# EAGLE design f-91ksd_r0 (EAGLE 7.7.0)
AUTHOR_NAME: koseidai
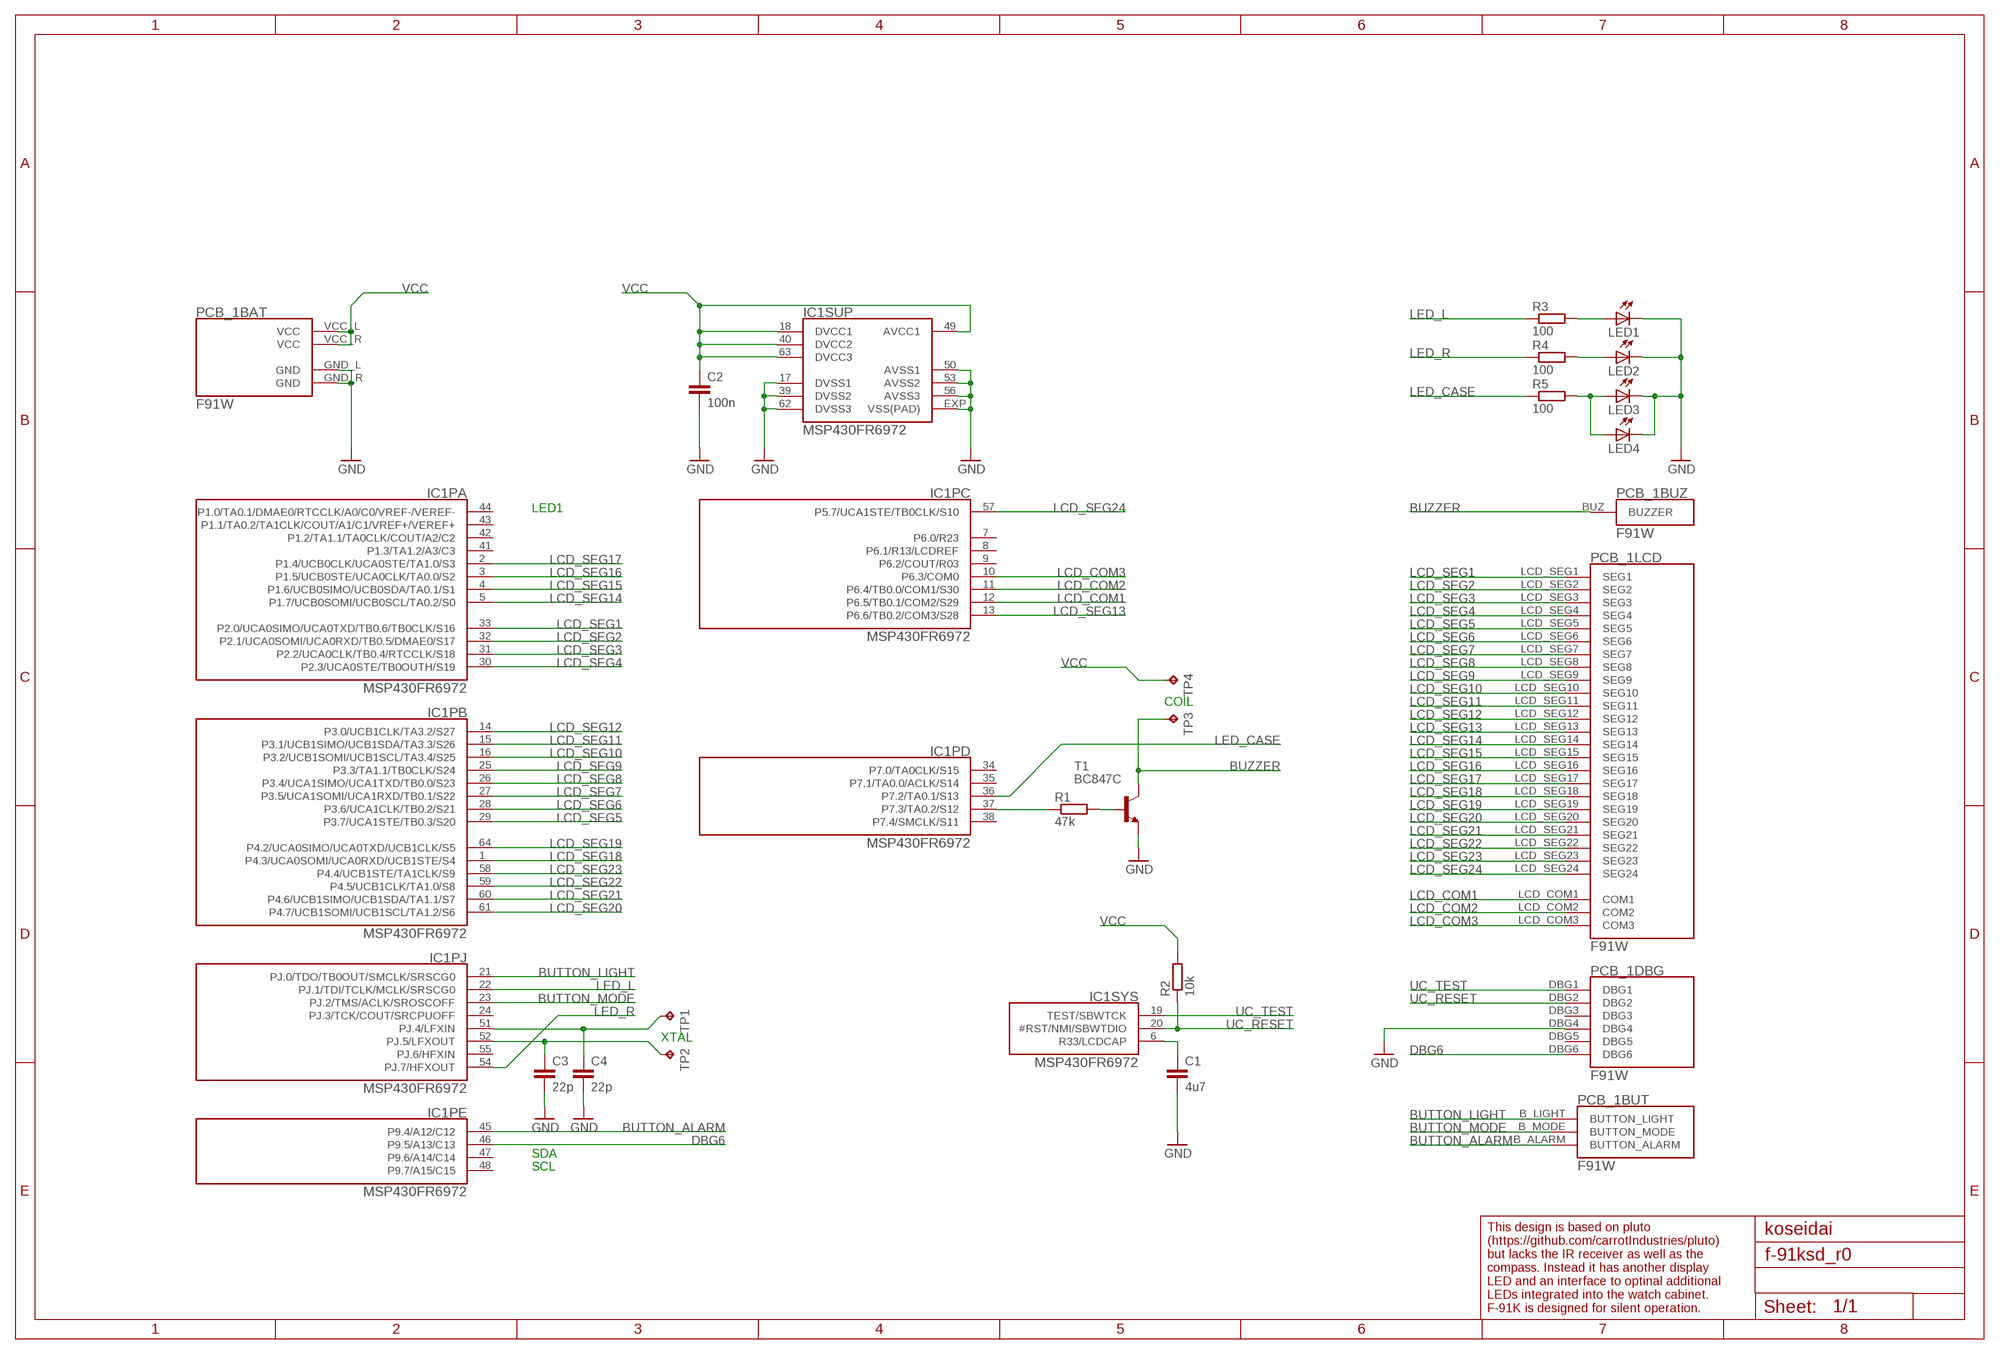
[diagram p0: schematic, sheet 1]

## Parts
C1  4u7  C-EUC0603-WW  [C0603-WW]
C2  100n  C-EUC0603-WW  [C0603-WW]
C3  22p  C-EUC0603-WW  [C0603-WW]
C4  22p  C-EUC0603-WW  [C0603-WW]
IC1  MSP430FR6972  [QFN64-9X9]
LED1  LEDCHIPLED_0805  [CHIPLED_0805]
LED2  LEDCHIPLED_0805  [CHIPLED_0805]
LED3  LEDCHIPLED_0603  [CHIPLED_0603]
LED4  LEDCHIPLED_0603  [CHIPLED_0603]
PCB_1  F91W  [F91W]
R1  47k  R-EU_R0603-WW  [R0603-WW]
R2  10k  R-EU_R0603-WW  [R0603-WW]
R3  100  R-EU_R0603-WW  [R0603-WW]
R4  100  R-EU_R0603-WW  [R0603-WW]
R5  100  R-EU_R0603-WW  [R0603-WW]
T1  BC847C  BC847C-NPN-SOT23-BEC  [SOT23-BEC]
TP1  TPTP07SQ  [TP07SQ]
TP2  TPTP07SQ  [TP07SQ]
TP3  TPTP11SQ  [TP11SQ]
TP4  TPTP11SQ  [TP11SQ]

## Nets
BUTTON_ALARM: IC1.45(PE:P9.4/A12/C12) PCB_1.B_ALARM(BUTTON_ALARM)
BUTTON_LIGHT: IC1.21(PJ:PJ.0/TDO/TB0OUT/SMCLK/SRSCG0) PCB_1.B_LIGHT(BUTTON_LIGHT)
BUTTON_MODE: IC1.23(PJ:PJ.2/TMS/ACLK/SROSCOFF) PCB_1.B_MODE(BUTTON_MODE)
BUZZER: PCB_1.BUZ(BUZZER) T1.C TP3.TP
DBG6: IC1.46(PE:P9.5/A13/C13) PCB_1.DBG6
GND: C1.2 C2.2 C3.2 C4.2 IC1.17(SUP:DVSS1) IC1.39(SUP:DVSS2) IC1.50(SUP:AVSS1) IC1.53(SUP:AVSS2) IC1.56(SUP:AVSS3) IC1.62(SUP:DVSS3) IC1.EXP(SUP:VSS(PAD)) LED1.C LED2.C LED3.C LED4.C PCB_1.DBG4 PCB_1.GND_L(GND) PCB_1.GND_R(GND) T1.E
LCD_COM1: IC1.12(PC:P6.5/TB0.1/COM2/S29) PCB_1.LCD_COM1(COM1)
LCD_COM2: IC1.11(PC:P6.4/TB0.0/COM1/S30) PCB_1.LCD_COM2(COM2)
LCD_COM3: IC1.10(PC:P6.3/COM0) PCB_1.LCD_COM3(COM3)
LCD_SEG1: IC1.33(PA:P2.0/UCA0SIMO/UCA0TXD/TB0.6/TB0CLK/S16) PCB_1.LCD_SEG1(SEG1)
LCD_SEG2: IC1.32(PA:P2.1/UCA0SOMI/UCA0RXD/TB0.5/DMAE0/S17) PCB_1.LCD_SEG2(SEG2)
LCD_SEG3: IC1.31(PA:P2.2/UCA0CLK/TB0.4/RTCCLK/S18) PCB_1.LCD_SEG3(SEG3)
LCD_SEG4: IC1.30(PA:P2.3/UCA0STE/TB0OUTH/S19) PCB_1.LCD_SEG4(SEG4)
LCD_SEG5: IC1.29(PB:P3.7/UCA1STE/TB0.3/S20) PCB_1.LCD_SEG5(SEG5)
LCD_SEG6: IC1.28(PB:P3.6/UCA1CLK/TB0.2/S21) PCB_1.LCD_SEG6(SEG6)
LCD_SEG7: IC1.27(PB:P3.5/UCA1SOMI/UCA1RXD/TB0.1/S22) PCB_1.LCD_SEG7(SEG7)
LCD_SEG8: IC1.26(PB:P3.4/UCA1SIMO/UCA1TXD/TB0.0/S23) PCB_1.LCD_SEG8(SEG8)
LCD_SEG9: IC1.25(PB:P3.3/TA1.1/TB0CLK/S24) PCB_1.LCD_SEG9(SEG9)
LCD_SEG10: IC1.16(PB:P3.2/UCB1SOMI/UCB1SCL/TA3.4/S25) PCB_1.LCD_SEG10(SEG10)
LCD_SEG11: IC1.15(PB:P3.1/UCB1SIMO/UCB1SDA/TA3.3/S26) PCB_1.LCD_SEG11(SEG11)
LCD_SEG12: IC1.14(PB:P3.0/UCB1CLK/TA3.2/S27) PCB_1.LCD_SEG12(SEG12)
LCD_SEG13: IC1.13(PC:P6.6/TB0.2/COM3/S28) PCB_1.LCD_SEG13(SEG13)
LCD_SEG14: IC1.5(PA:P1.7/UCB0SOMI/UCB0SCL/TA0.2/S0) PCB_1.LCD_SEG14(SEG14)
LCD_SEG15: IC1.4(PA:P1.6/UCB0SIMO/UCB0SDA/TA0.1/S1) PCB_1.LCD_SEG15(SEG15)
LCD_SEG16: IC1.3(PA:P1.5/UCB0STE/UCA0CLK/TA0.0/S2) PCB_1.LCD_SEG16(SEG16)
LCD_SEG17: IC1.2(PA:P1.4/UCB0CLK/UCA0STE/TA1.0/S3) PCB_1.LCD_SEG17(SEG17)
LCD_SEG18: IC1.1(PB:P4.3/UCA0SOMI/UCA0RXD/UCB1STE/S4) PCB_1.LCD_SEG18(SEG18)
LCD_SEG19: IC1.64(PB:P4.2/UCA0SIMO/UCA0TXD/UCB1CLK/S5) PCB_1.LCD_SEG19(SEG19)
LCD_SEG20: IC1.61(PB:P4.7/UCB1SOMI/UCB1SCL/TA1.2/S6) PCB_1.LCD_SEG20(SEG20)
LCD_SEG21: IC1.60(PB:P4.6/UCB1SIMO/UCB1SDA/TA1.1/S7) PCB_1.LCD_SEG21(SEG21)
LCD_SEG22: IC1.59(PB:P4.5/UCB1CLK/TA1.0/S8) PCB_1.LCD_SEG22(SEG22)
LCD_SEG23: IC1.58(PB:P4.4/UCB1STE/TA1CLK/S9) PCB_1.LCD_SEG23(SEG23)
LCD_SEG24: IC1.57(PC:P5.7/UCA1STE/TB0CLK/S10) PCB_1.LCD_SEG24(SEG24)
LED_CASE: IC1.36(PD:P7.2/TA0.1/S13) R5.1
LED_L: IC1.22(PJ:PJ.1/TDI/TCLK/MCLK/SRSCG0) R3.1
LED_R: IC1.54(PJ:PJ.7/HFXOUT) R4.1
N$1: C1.1 IC1.6(SYS:R33/LCDCAP)
N$2: IC1.37(PD:P7.3/TA0.2/S12) R1.1
N$3: C4.1 IC1.51(PJ:PJ.4/LFXIN) TP1.TP
N$4: C3.1 IC1.52(PJ:PJ.5/LFXOUT) TP2.TP
N$5: R1.2 T1.B
N$6: LED3.A LED4.A R5.2
N$8: LED1.A R3.2
N$9: LED2.A R4.2
UC_RESET: IC1.20(SYS:#RST/NMI/SBWTDIO) PCB_1.DBG2 R2.1
UC_TEST: IC1.19(SYS:TEST/SBWTCK) PCB_1.DBG1
VCC: C2.1 IC1.18(SUP:DVCC1) IC1.40(SUP:DVCC2) IC1.49(SUP:AVCC1) IC1.63(SUP:DVCC3) PCB_1.VCC_L(VCC) PCB_1.VCC_R(VCC) R2.2 TP4.TP
Unconnected: IC1.7(PC:P6.0/R23) IC1.8(PC:P6.1/R13/LCDREF) IC1.9(PC:P6.2/COUT/R03) IC1.24(PJ:PJ.3/TCK/COUT/SRCPUOFF) IC1.34(PD:P7.0/TA0CLK/S15) IC1.35(PD:P7.1/TA0.0/ACLK/S14) IC1.38(PD:P7.4/SMCLK/S11) IC1.41(PA:P1.3/TA1.2/A3/C3) IC1.42(PA:P1.2/TA1.1/TA0CLK/COUT/A2/C2) IC1.43(PA:P1.1/TA0.2/TA1CLK/COUT/A1/C1/VREF+/VEREF+) IC1.44(PA:P1.0/TA0.1/DMAE0/RTCCLK/A0/C0/VREF-/VEREF-) IC1.47(PE:P9.6/A14/C14) IC1.48(PE:P9.7/A15/C15) IC1.55(PJ:PJ.6/HFXIN) PCB_1.DBG3 PCB_1.DBG5

## Notes on the sheet
- LED1
- COIL
- XTAL
- SDA
- SCL
- This design is based on pluto 
  (https://github.com/carrotIndustries/pluto)
  but lacks the IR receiver as well as the 
  compass. Instead it has another display 
  LED and an interface to optinal additional 
  LEDs integrated into the watch cabinet.
  F-91K is designed for silent operation.

## Library data of the parts
C1-C4 = rcl:C-EU: CAPACITOR, European symbol
IC1 = ks-eurorack:MSP430FR6972: MSP430FR6972 Mixed‑Signal Microcontroller
LED1-LED4 = led:LED: LED OSRAM: - CHIPLED LG R971, LG N971, LY N971, LG Q971, LY Q971, LO R971, LY R971 LH N974, LH R974 LS Q976, LO Q976, LY Q976 LO Q996 - Hyper CHIPLED LW Q18S LB Q993, LB Q99A, LB R99A - SideLED LS A670, LO A670, LY A670, LG A670, LP A670 LB A673, LV A673, LT A673, LW A673 LH A674 LY A675 LS A676, LA A676, LO A676, LY A676, LW A676 LS A679, LY A679, LG A679 - Hyper Micro SIDELED® LS Y876, LA Y876, LO Y876, LY Y876 LT Y87S - SmartLED LW L88C, LW L88S LB L89C, LB L89S, LG L890 LS L89K, LO L89K, LY L89K LS L896, LA L896, LO L896, LY L896 - TOPLED LS T670, LO T670, LY T670, LG T670, LP T670 LSG T670, LSP T670, LSY T670, LOP T670, LYG T670 LG T671, LOG T671, LSG T671 LB T673, LV T673, LT T673, LW T673 LH T674 LS T676, LA T676, LO T676, LY T676, LB T676, LH T676, LSB T676, LW T676 LB T67C, LV T67C, LT T67C, LS T67K, LO T67K, LY T67K, LW E67C LS E67B, LA E67B, LO E67B, LY E67B, LB E67C, LV E67C, LT E67C LW T67C LS T679, LY T679, LG T679 LS T770, LO T770, LY T770, LG T770, LP T770 LB T773, LV T773, LT T773, LW T773 LH T774 LS E675, LA E675, LY E675, LS T675 LS T776, LA T776, LO T776, LY T776, LB T776 LHGB T686 LT T68C, LB T68C - Hyper Mini TOPLED® LB M676 - Mini TOPLED Santana® LG M470 LS M47K, LO M47K, LY M47K Source: http://www.osram.convergy.de LUXEON: - LUMILED® LXK2-PW12-R00, LXK2-PW12-S00, LXK2-PW14-U00, LXK2-PW14-V00 LXK2-PM12-R00, LXK2-PM12-S00, LXK2-PM14-U00 LXK2-PE12-Q00, LXK2-PE12-R00, LXK2-PE12-S00, LXK2-PE14-T00, LXK2-PE14-U00 LXK2-PB12-K00, LXK2-PB12-L00, LXK2-PB12-M00, LXK2-PB14-N00, LXK2-PB14-P00, LXK2-PB14-Q00 LXK2-PR12-L00, LXK2-PR12-M00, LXK2-PR14-Q00, LXK2-PR14-R00 LXK2-PD12-Q00, LXK2-PD12-R00, LXK2-PD12-S00 LXK2-PH12-R00, LXK2-PH12-S00 LXK2-PL12-P00, LXK2-PL12-Q00, LXK2-PL12-R00 Source: www.luxeon.com KINGBRIGHT: KA-3528ASYC Source: www.kingbright.com
PCB_1 = f-91w:F91W: Casio® F-91W main PCB Main PCB of the classic Casio® F-91W wristwatch. Requires ENIG surface finish and 0.6 mm PCB thickness.
R1-R5 = rcl:R-EU_: RESISTOR, European symbol
T1 = transistor:*-NPN-: NPN Transistror BF959 corrected 2008.03.06
TP1-TP4 = testpad:TP: Test pad

## Board
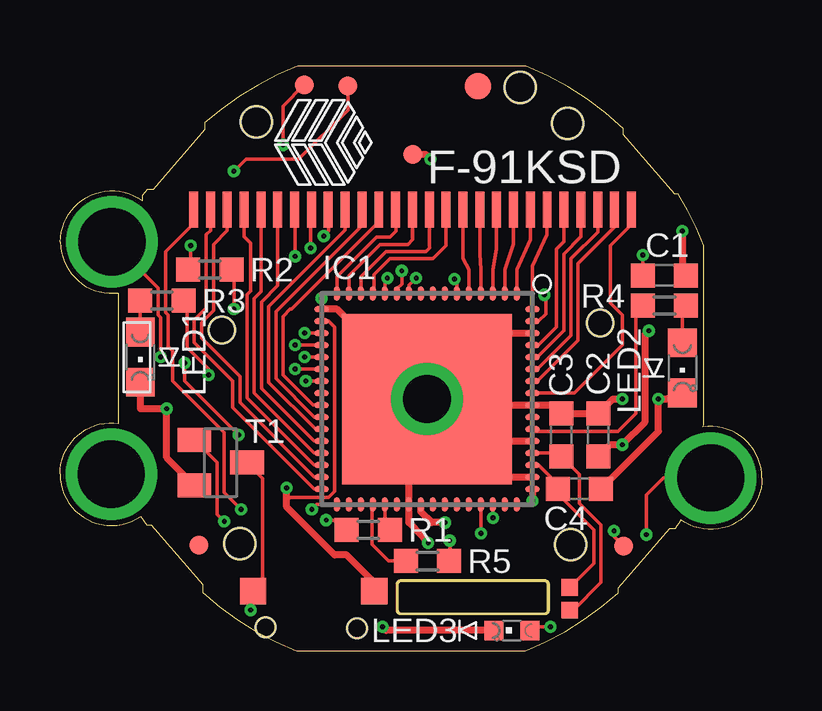
[diagram p1: board, top side]
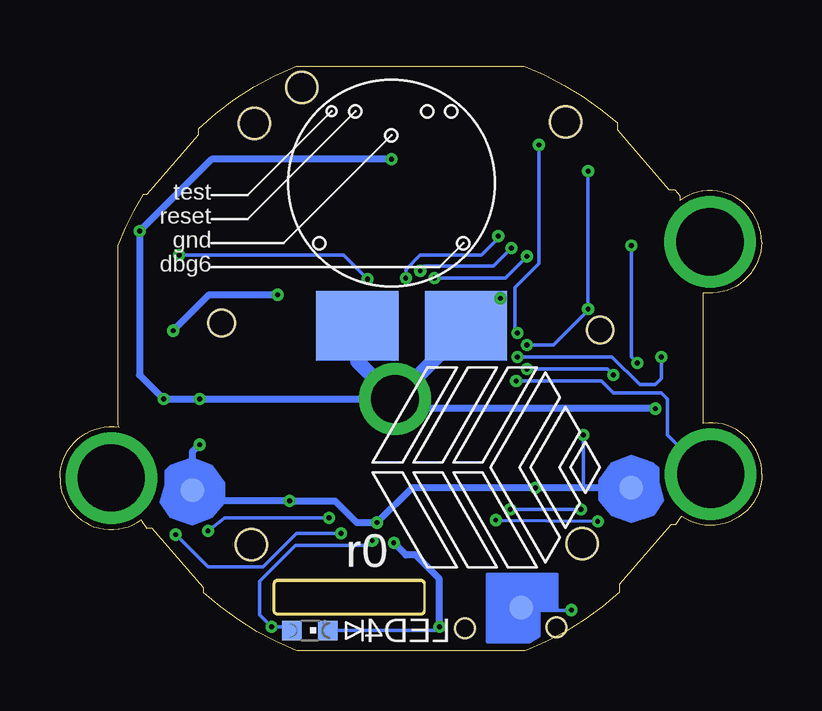
[diagram p2: board, bottom side, seen from below]

Size 29.27 x 24.38 mm. Coordinates in mm from the lower left corner, seen from the top.
Copper layers (1*16): Top 0.035mm / dielectric 1.5mm / Bottom 0.035mm
Design rules "jlcpcb_single_dual *": minimum track width 5mil, minimum drill 0.2mm, track to track 5mil, track to pad 5mil, pad to pad 5mil, via to via 5mil, smd to smd 0mil, copper to edge 0.2mm, drill to drill 10mil, minimum pad ring 10mil, minimum via ring 6mil, stop-mask expansion 2mil, vias tented up to drill 100mil, thermal gap 10mil

### Footprints (pad centres in the part's own frame; a part is rotated, then mirrored left to right if it is on the bottom)
C0603-WW = smd 1 x 1: 1 -0.9,0; 2 0.9,0
QFN64-9X9 = smd 0.6 x 0.25: 1 -4.4,3.75; 2 -4.4,3.25; 3 -4.4,2.75; 4 -4.4,2.25; 5 -4.4,1.75; 6 -4.4,1.25; 7 -4.4,0.75; 8 -4.4,0.25; 9 -4.4,-0.25; 10 -4.4,-0.75; 11 -4.4,-1.25; 12 -4.4,-1.75; 13 -4.4,-2.25; 14 -4.4,-2.75; 15 -4.4,-3.25; 16 -4.4,-3.75; 33 4.4,-3.75; 34 4.4,-3.25; 35 4.4,-2.75; 36 4.4,-2.25; 37 4.4,-1.75; 38 4.4,-1.25; 39 4.4,-0.75; 40 4.4,-0.25; 41 4.4,0.25; 42 4.4,0.75; 43 4.4,1.25; 44 4.4,1.75; 45 4.4,2.25; 46 4.4,2.75; 47 4.4,3.25; 48 4.4,3.75 | smd 0.25 x 0.6: 17 -3.75,-4.4; 18 -3.25,-4.4; 19 -2.75,-4.4; 20 -2.25,-4.4; 21 -1.75,-4.4; 22 -1.25,-4.4; 23 -0.75,-4.4; 24 -0.25,-4.4; 25 0.25,-4.4; 26 0.75,-4.4; 27 1.25,-4.4; 28 1.75,-4.4; 29 2.25,-4.4; 30 2.75,-4.4; 31 3.25,-4.4; 32 3.75,-4.4; 49 3.75,4.4; 50 3.25,4.4; 51 2.75,4.4; 52 2.25,4.4; 53 1.75,4.4; 54 1.25,4.4; 55 0.75,4.4; 56 0.25,4.4; 57 -0.25,4.4; 58 -0.75,4.4; 59 -1.25,4.4; 60 -1.75,4.4; 61 -2.25,4.4; 62 -2.75,4.4; 63 -3.25,4.4; 64 -3.75,4.4 | smd 7.1 x 7.1: EXP 0,0
CHIPLED_0805 = smd 1.2 x 1.2: A 0,-1.05; C 0,1.05
CHIPLED_0603 = smd 0.8 x 0.8: A 0,-0.75; C 0,0.75
F91W = drill 2.8: B_ALARM 24.68,7.21; B_LIGHT -0.28,17.06; B_MODE -0.31,7.37 | smd 1 x 1 bottom: BUZ 7.6,1.8; VCC_L 21.3,6.7; VCC_R 3,6.8 | smd 0.8 x 0.8: DBG1 7.73,23.6; DBG2 9.55,23.55; DBG4 12.25,20.71; DBG5 3.34,4.42; DBG6 21.06,4.37 | smd 1.1 x 1.1: DBG3 14.97,23.54 | smd 3.43 x 2.9 bottom: GND_L 14.42,13.56; GND_R 9.89,13.56 | smd 0.373 x 1.509: LCD_COM1 7.332,18.4; LCD_COM2 8.034,18.4; LCD_COM3 8.736,18.4; LCD_SEG1 3.12,18.4; LCD_SEG2 3.822,18.4; LCD_SEG3 4.524,18.4; LCD_SEG4 5.226,18.4; LCD_SEG5 5.928,18.4; LCD_SEG6 6.63,18.4; LCD_SEG7 9.438,18.4; LCD_SEG8 10.14,18.4; LCD_SEG9 10.842,18.4; LCD_SEG10 11.544,18.4; LCD_SEG11 12.246,18.4; LCD_SEG12 12.948,18.4; LCD_SEG13 13.65,18.4; LCD_SEG14 14.352,18.4; LCD_SEG15 15.054,18.4; LCD_SEG16 15.756,18.4; LCD_SEG17 16.458,18.4; LCD_SEG18 17.16,18.4; LCD_SEG19 17.862,18.4; LCD_SEG20 18.564,18.4; LCD_SEG21 19.266,18.4; LCD_SEG22 19.968,18.4; LCD_SEG23 20.67,18.4; LCD_SEG24 21.372,18.4 | hole 1.3: 5.74,22.06; 18.71,21.99; 5.045,4.465; 18.845,4.43; 16.735,23.495 | hole 1.1: 4.3,13.38; 20.075,13.67 | hole 0.81: 6.125,0.99; 9.94,0.94
R0603-WW = smd 1 x 1: 1 -0.9,0; 2 0.9,0
SOT23-BEC = smd 1 x 1.4: B -0.95,-1.1; C 0,1.1; E 0.95,-1.1
TP07SQ = smd 0.7 x 0.7: TP 0,0
TP11SQ = smd 1.1 x 1.1: TP 0,0

### Placement (x,y rotation side)
C1  25.2,15.65 0 top
C2  22.45,9 90 top
C3  20.9,9 90 top
C4  21.65,6.75 0 top
IC1  15.3,10.5 270 top
LED1  3.35,12.25 180 top
LED2  25.95,11.8 180 top
LED3  18.85,0.85 90 top
LED4  18.85,0.85 270 bottom
PCB_1  2.45,0 0 top
R1  12.85,5.05 180 top
R2  6.25,15.9 180 top
R3  4.25,14.6 180 top
R4  25.2,14.4 0 top
R5  15.32,3.74 0 top
T1  6.7,7.85 270 top
TP1  21.25,2.65 0 top
TP2  21.25,1.7 0 top
TP3  8.05,2.5 0 top
TP4  13.1,2.5 0 top

### Tracks (layer width: path | path; a pad name or v marks a point on that pad's centre or on a via)
BUTTON_ALARM  (via drill 0.2)
  Top 0.15: v17.55,4.9 IC1.45 | v24.45,4.85 24.45,6.5 25.16,7.21 PCB_1.B_ALARM
  Bottom 0.15: v17.55,4.9 19.4,4.9 20.8,3.5 23.1,3.5 v24.45,4.85
BUTTON_LIGHT  (via drill 0.2)
  Top 0.15: IC1.21 v10.2,12.25 | v4.2,12.25 4.2,13.9 4.1,14 4.1,15.13 PCB_1.B_LIGHT
  Bottom 0.15: v10.2,12.25 6.25,12.25 5.1,11.1 4.45,11.1 4.2,11.35 v4.2,12.25
BUTTON_MODE  (via drill 0.2)
  Top 0.15: IC1.23 v10.25,11.25
  Bottom 0.15: v10.25,11.25 6.7,11.25 6.2,10.75 4.2,10.75 3.95,10.5 3.95,9 2.45,7.5 PCB_1.B_MODE
BUZZER  (via drill 0.2)
  Top 0.15: v7.95,1.7 7.95,2.5 TP3.TP 8.45,2.9 8.45,7.2 T1.C 8.05,7.6
  Bottom 0.15: v7.95,1.7 9.95,1.7 PCB_1.BUZ
DBG6  (via drill 0.2)
  Top 0.15: IC1.46 v18.05,5.55 | v23.1,5 23.1,4.78 PCB_1.DBG6
  Bottom 0.15: v18.05,5.55 22.4,5.55 v23.1,5
GND  (via drill 0.2, 2)
  Top 0.15: IC1.17 v10.9,14.7 | 14.55,9.75 IC1.EXP | IC1.EXP 18.55,7.25 | IC1.EXP 17.05,8.75 | IC1.EXP 15.55,10.25 | IC1.EXP 18.05,13.25 | 20.55,10.25 C3.2
  Top 0.3: 14.55,9.75 IC1.39 14.55,5.35 15.1,4.8 v15.35,4.5 | 18.55,7.25 IC1.50 | 17.05,8.75 IC1.53 | 15.55,10.25 IC1.56 20.55,10.25 | 18.05,13.25 IC1.62 | IC1.EXP 11.55,14.25 IC1.17 | C3.2 C2.2 23.05,10.5 v23.45,10.5 | LED2.C 25.25,10.5 v24.95,10.5 24.95,9.15 C4.2 | LED1.C 3.35,10.1 v4.45,10.1 4.45,8.05 T1.E | PCB_1.DBG4 15.24,20.71 v15.45,20.5 | v25.95,17.5 25.95,15.8 C1.2 | LED4.C 13.6,0.85 v13.45,1
  Bottom 0.15: LED4.C 13.6,0.85 v13.45,1
  Bottom 0.3: v4.45,10.1 14.9,10.1 IC1.EXP v24.95,10.5 25.95,11.5 v25.95,17.5 22.95,20.5 v15.45,20.5 | v13.45,1 13.45,3 14.45,4 14.85,4 v15.35,4.5
  Bottom 0.61: PCB_1.GND_L 16.87,12.07 IC1.EXP 12.34,13.46 PCB_1.GND_R
  other vias: 15.3,10.5
LCD_COM1  (via drill 0.2)
  Top 0.15: v9.8,16.45 9.8,18.38 PCB_1.LCD_COM1 | IC1.12 13.55,15.45 v13.65,15.55
  Bottom 0.15: v13.65,15.55 10.7,15.55 v9.8,16.45
LCD_COM2  (via drill 0.2)
  Top 0.15: IC1.11 14.05,15.1 14.25,15.3 14.25,15.6 v14.25,15.85 | v10.45,16.8 10.45,18.37 PCB_1.LCD_COM2
  Bottom 0.15: v14.25,15.85 14.1,16.05 11.2,16.05 v10.45,16.8
LCD_COM3  (via drill 0.2)
  Top 0.15: IC1.10 14.55,15.25 v14.85,15.55 | v11,17.3 11.2,17.5 11.2,18.39 PCB_1.LCD_COM3
  Bottom 0.15: v14.85,15.55 14.85,15.9 14.25,16.5 11.7,16.5 11.1,17.1 v11,17.3
LCD_SEG1  (via drill 0.2)
  Top 0.15: IC1.33 10.7,6.1 v10.5,5.9 | v7.55,5.9 6.85,6.6 6.85,9.1 4.7,11.25 4.7,12.5 4.5,12.7 4.5,14 4.4,14.1 4.4,16.65 5.57,17.82 PCB_1.LCD_SEG1
  Bottom 0.15: v10.5,5.9 v7.55,5.9
LCD_SEG2
  Top 0.15: IC1.32 10.6,6.75 7.2,10.15 7.2,11.25 5.6,12.85 5.6,13.8 6.1,14.3 6.1,17.35 6.27,17.52 PCB_1.LCD_SEG2
LCD_SEG3
  Top 0.15: IC1.31 10.6,7.25 7.5,10.35 7.5,11.45 5.9,13.05 5.9,13.7 6.4,14.2 6.4,16.95 6.97,17.52 PCB_1.LCD_SEG3
LCD_SEG4
  Top 0.15: IC1.30 10.6,7.75 7.8,10.55 7.8,14.85 7.95,15 7.95,17 7.68,17.27 PCB_1.LCD_SEG4
LCD_SEG5
  Top 0.15: IC1.29 10.6,8.25 8.1,10.75 8.1,14.7 8.38,14.98 PCB_1.LCD_SEG5
LCD_SEG6
  Top 0.15: IC1.28 10.6,8.75 8.4,10.95 8.4,14.55 9.08,15.23 PCB_1.LCD_SEG6
LCD_SEG7
  Top 0.15: IC1.27 10.65,9.25 8.7,11.2 8.7,14.35 11.89,17.54 PCB_1.LCD_SEG7
LCD_SEG8
  Top 0.15: IC1.26 10.6,9.75 9,11.35 9,14.15 12.59,17.74 PCB_1.LCD_SEG8
LCD_SEG9
  Top 0.15: IC1.25 10.55,10.25 9.3,11.5 9.3,13.95 9.6,14.25 9.65,14.25 13.29,17.89 PCB_1.LCD_SEG9
LCD_SEG10
  Top 0.15: IC1.16 11.55,15.6 13.2,17.25 13.75,17.25 14,17.5 PCB_1.LCD_SEG10
LCD_SEG11
  Top 0.15: IC1.15 12.05,15.65 13.35,16.95 14.5,16.95 14.7,17.15 PCB_1.LCD_SEG11
LCD_SEG12
  Top 0.15: IC1.14 12.55,15.6 13.6,16.65 15.25,16.65 15.4,16.8 PCB_1.LCD_SEG12
LCD_SEG13
  Top 0.15: IC1.13 13.1,15.05 13.1,15.7 13.75,16.35 15.55,16.35 16.1,16.9 PCB_1.LCD_SEG13
LCD_SEG14
  Top 0.15: IC1.5 17.05,15.9 16.8,16.35 PCB_1.LCD_SEG14
LCD_SEG15
  Top 0.15: IC1.4 17.55,15.9 17.5,16.55 PCB_1.LCD_SEG15
LCD_SEG16
  Top 0.15: IC1.3 18.05,15.9 18.21,16.76 PCB_1.LCD_SEG16
LCD_SEG17
  Top 0.15: IC1.2 18.55,15.9 18.91,16.96 PCB_1.LCD_SEG17
LCD_SEG18
  Top 0.15: IC1.1 19.05,15.9 19.61,17.16 PCB_1.LCD_SEG18
LCD_SEG19
  Top 0.15: IC1.64 19.7,16.05 20.31,17.36 PCB_1.LCD_SEG19
LCD_SEG20
  Top 0.15: IC1.61 19.95,12.75 20.7,13.5 20.7,16.75 21.01,17.06 PCB_1.LCD_SEG20
LCD_SEG21
  Top 0.15: IC1.60 19.9,12.25 21,13.35 21,16.55 21.72,17.27 PCB_1.LCD_SEG21
LCD_SEG22
  Top 0.15: IC1.59 19.9,11.75 21.3,13.15 21.3,16.35 22.42,17.47 PCB_1.LCD_SEG22
LCD_SEG23
  Top 0.15: IC1.58 19.9,11.25 21.6,12.95 21.6,16.15 23.12,17.67 PCB_1.LCD_SEG23
LCD_SEG24
  Top 0.15: IC1.57 21.45,10.75 23.45,12.75 23.45,14 22.95,14.5 22.95,16.9 23.85,17.8 23.85,18.37 PCB_1.LCD_SEG24
LED_CASE
  Top 0.15: IC1.36 13,6.05 13,4.45 13.71,3.75 R5.1
LED_L  (via drill 0.2)
  Top 0.15: IC1.22 v9.8,11.75 | v6.2,11.5 6.2,11.75 5.3,12.65 5.3,14.45 R3.1
  Bottom 0.15: v9.8,11.75 6.45,11.75 v6.2,11.5
LED_R
  Top 0.15: IC1.54 19.8,9.15 23.25,9.15 24,9.9 24,14.2 R4.1
N$1  (via drill 0.2)
  Top 0.15: v16.45,15.5 16.55,15.4 IC1.6 | C1.1 v24.3,16.5
  Bottom 0.15: v24.3,16.5 17.45,16.5 v16.45,15.5
N$2
  Top 0.15: IC1.37 13.55,5.45 R1.1
N$3
  Top 0.15: IC1.51 19.95,7.75 20.75,6.95 C4.1 20.75,6.5 20.8,6.5 22.25,5.05 22.25,3.65 TP1.TP
N$4
  Top 0.15: IC1.52 20.75,8.25 C3.1 21.65,7.35 21.65,6.15 22.55,5.25 22.55,2.85 21.4,1.7 TP2.TP
N$5  (via drill 0.2)
  Top 0.15: R1.2 11.55,5.45 v11.1,5.45 | v6.85,5.4 6.55,5.7 6.55,7.85 T1.B
  Bottom 0.15: v11.1,5.45 v6.85,5.4
N$6  (via drill 0.2)
  Top 0.15: R5.2 16.25,3.79 v16.25,4.6 | v20.45,1 19.75,1 LED4.A
  Bottom 0.15: v16.25,4.6 16.45,4.4 19.45,4.4 20.95,2.9 20.95,1.5 v20.45,1 19.75,1 LED4.A
N$8
  Top 0.15: LED1.A R3.2
N$9
  Top 0.15: R4.2 25.95,14.25 LED2.A
UC_RESET  (via drill 0.2)
  Top 0.15: IC1.20 v9.8,12.75 | v7.25,14.25 7.25,16 R2.1 | PCB_1.DBG2 12,22.55 9.95,20.5 7.75,20.5 v7.25,20
  Bottom 0.15: v9.8,12.75 8.7,12.75 7.25,14.2 v7.25,14.25 v7.25,20
UC_TEST  (via drill 0.2)
  Top 0.15: IC1.19 v10.2,13.25 | v9.3,21.1 9.3,22.72 PCB_1.DBG1
  Bottom 0.15: v10.2,13.25 10.3,13.35 10.3,15.15 9.3,16.15 v9.3,21.1
VCC  (via drill 0.2)
  Top 0.15: IC1.63 19.95,13.75 20.25,14.05 20.25,14.8 v20.2,14.85 | IC1.18 11.2,13.75 11.45,13.5 11.45,6.65 11.2,6.4 9.5,6.4 9.45,6.35 | R2.2 5.45,15.95 v5.45,16.9 | v5.2,12 5.2,11.25 v7.45,9
  Top 0.3: C2.1 22.95,8.6 v23.45,8.6 24.4,9.55 24.4,13.2 v24.55,13.35 | IC1.49 v19.7,6.25 | v16.05,5.35 15.5,5.35 15.05,5.8 IC1.40 | TP4.TP 13.1,2.85 11.95,4 11.45,4 9.45,6 9.45,6.35 v9.45,6.8
  Bottom 0.15: v5.45,16.9 5.45,12.25 v5.2,12 | v7.45,9 7.45,6.8
  Bottom 0.3: PCB_1.VCC_R 7.45,6.8 v9.45,6.8 14.6,6.8 v16.05,5.35 16.9,5.35 17.8,6.25 v19.7,6.25 23.3,6.25 PCB_1.VCC_L 23.75,8.3 v23.45,8.6 | v24.55,13.35 23.05,14.85 v20.2,14.85

### Text on the board
tSilkscreen: F-91KSD
bSilkscreen: test | gnd | reset | dbg6 | r0